# EAGLE schematic macropad_synthplug (EAGLE 9.6.2)
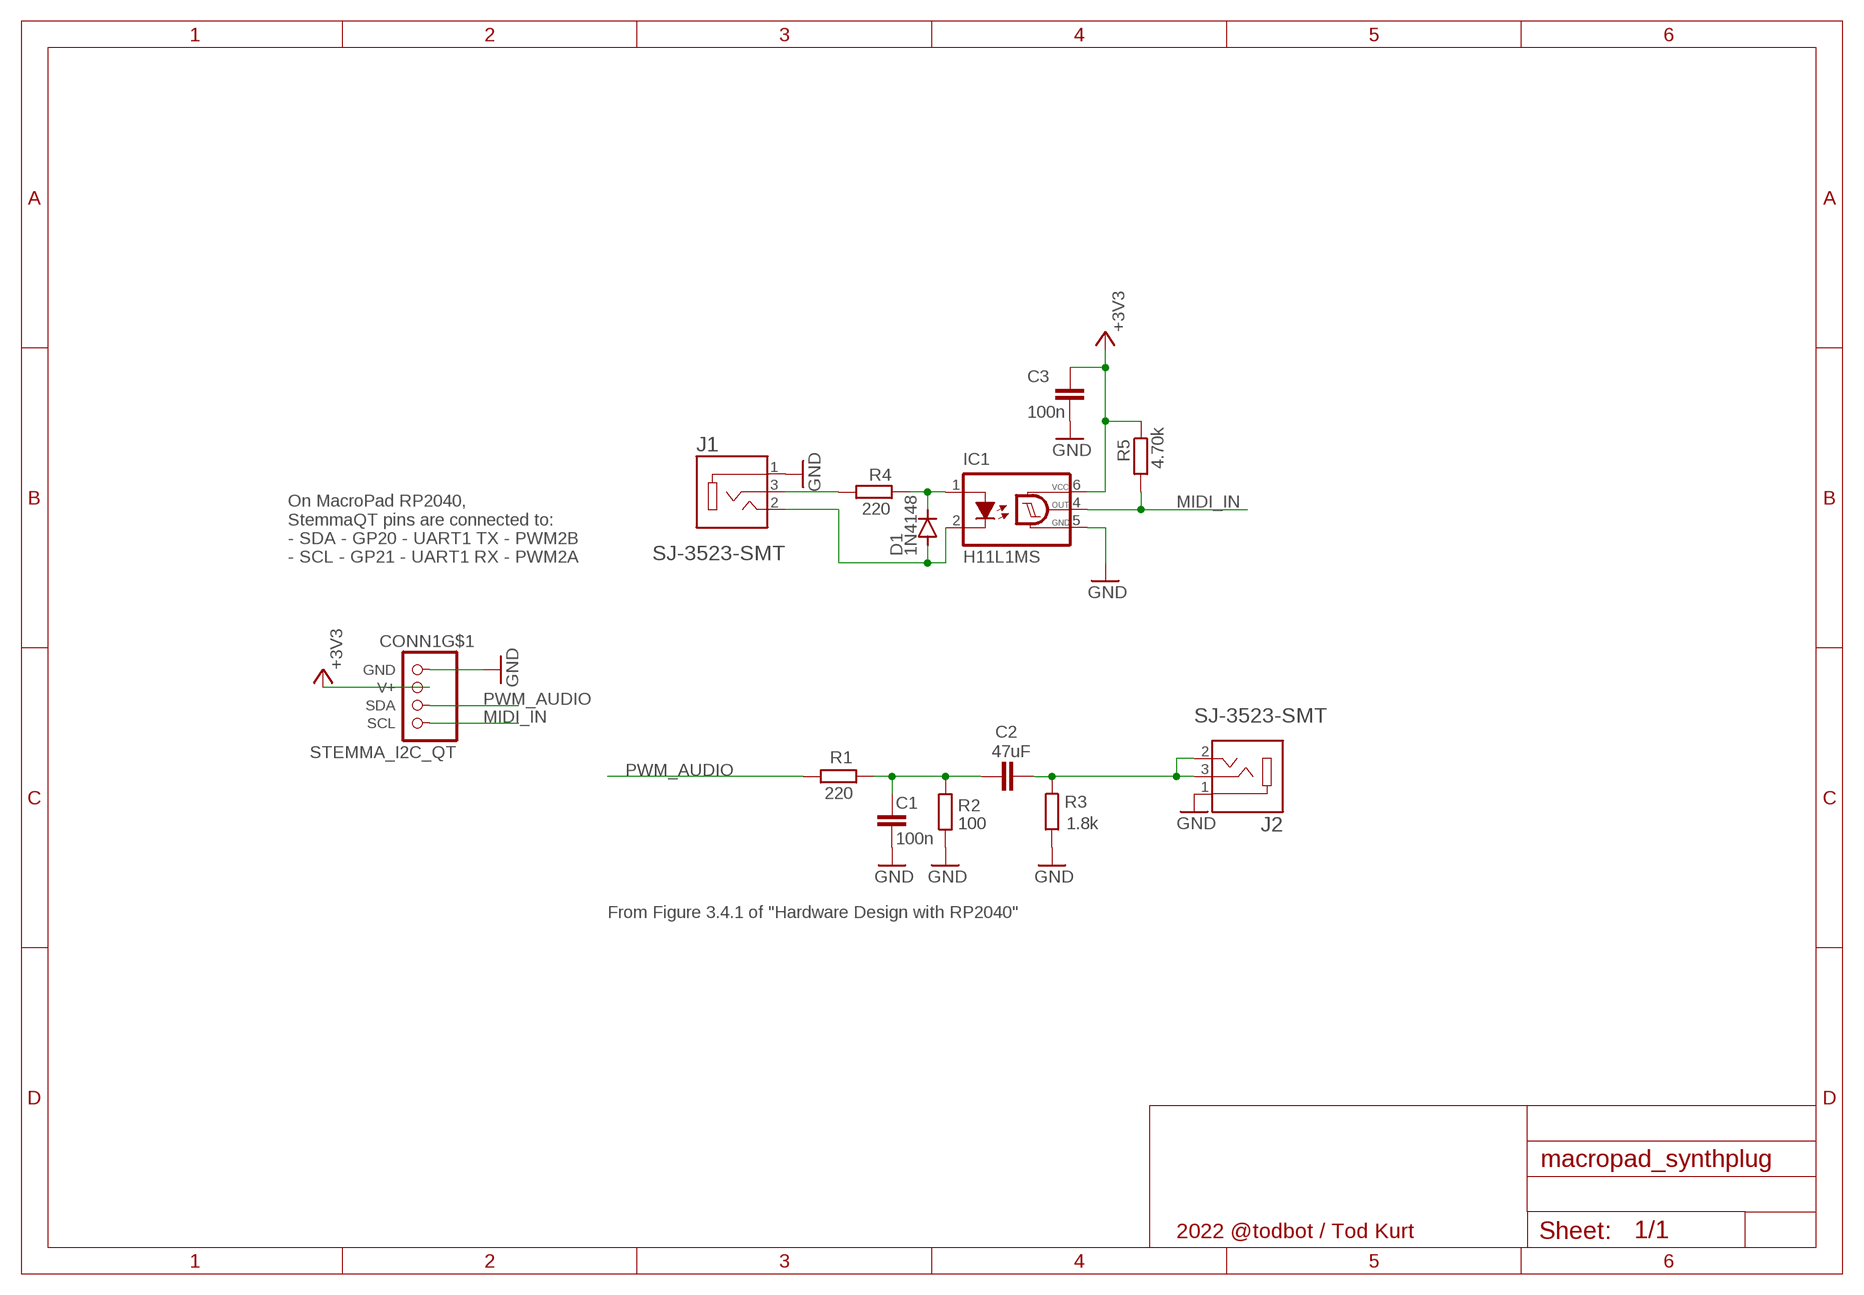
[diagram p0: schematic, sheet 1]

## Parts
C1  100n  C-EUC0805  [C0805]
C2  47uF  C-EUC0805  [C0805]
C3  100n  C-EUC0805  [C0805]
CONN1  STEMMA_I2C_QT  [JST_SH4]
D1  1N4148  DIODE-SOD123  [SOD123]
IC1  H11L1MS  [DIL6-SMD]
J1  SJ-3523-SMT  [CUI_SJ-3523-SMT]
J2  SJ-3523-SMT  [CUI_SJ-3523-SMT]
R1  220  R-EU_R0805  [R0805]
R2  100  R-EU_R0805  [R0805]
R3  1.8k  R-EU_R0805  [R0805]
R4  220  R-EU_R0805  [R0805]
R5  4.70k  R-EU_R0805  [R0805]

## Nets
+3V3: C3.1 CONN1.2(V+) IC1.6(VCC) R5.1
GND: C1.2 C3.2 CONN1.1(GND) IC1.5(GND) J1.1 J2.1 R2.1 R3.2
MIDI_IN: CONN1.4(SCL) IC1.4(OUT) R5.2
N$13: D1.C IC1.1(A) R4.1
N$14: D1.A IC1.2(C) J1.2
N$15: J1.3 R4.2
N$47: C2.2 J2.2 J2.3 R3.1
N$48: C1.1 C2.1 R1.1 R2.2
PWM_AUDIO: CONN1.3(SDA) R1.2
Unconnected: CONN1.MT1(MT) CONN1.MT2(MT)

## Notes on the sheet
- On MacroPad RP2040, 
  StemmaQT pins are connected to:
  - SDA - GP20 - UART1 TX - PWM2B
  - SCL - GP21 - UART1 RX - PWM2A
- From Figure 3.4.1 of "Hardware Design with RP2040"
- 2022 @todbot / Tod Kurt

## Library data of the parts
C1-C3 = rcl:C-EU: CAPACITOR, European symbol; SPICEPREFIX: C
CONN1 = adafruit_electromech:STEMMA_I2C; LCSC: C2845363
D1 = diode:DIODE-: DIODE
IC1 = optocoupler:H11L*M: 6-Pin DIP Optocoupler Source: http://www.fairchildsemi.com/ds/H1/H11L2-M.pdf; OC_FARNELL: unknown; OC_NEWARK: unknown
J1 J2 = SJ-3523-SMT:SJ-3523-SMT: Audio Jack Connector 3.5 mm Low Profile Surface Mount Stereo Jack, 3 Pin Right-Angle; CUI_PURCHASE_URL: https://www.cuidevices.com/product/interconnect/connectors/audio-connectors/jacks/sj-352x-smt-series?utm_source=snapeda.com&utm_medium=referral&utm_campaign=snapedaBOM; DESCRIPTION: 3.5 mm, Stereo, Right Angle, Surface Mount (SMT), 3 Conductors, 0~1 Internal Switches, Audio Jack Connector; DIGI-KEY_PART_NUMBER: CP-3523SJCT-ND; MF: CUI Devices; MP: SJ-3523-SMT-TR; PACKAGE: None; PURCHASE-URL: https://pricing.snapeda.com/search/part/SJ-3523-SMT-TR/?ref=eda
R1-R5 = rcl:R-EU_: RESISTOR, European symbol; SPICEPREFIX: R